# Altium schematic sheet GPIO_M2.SchDoc
size A4
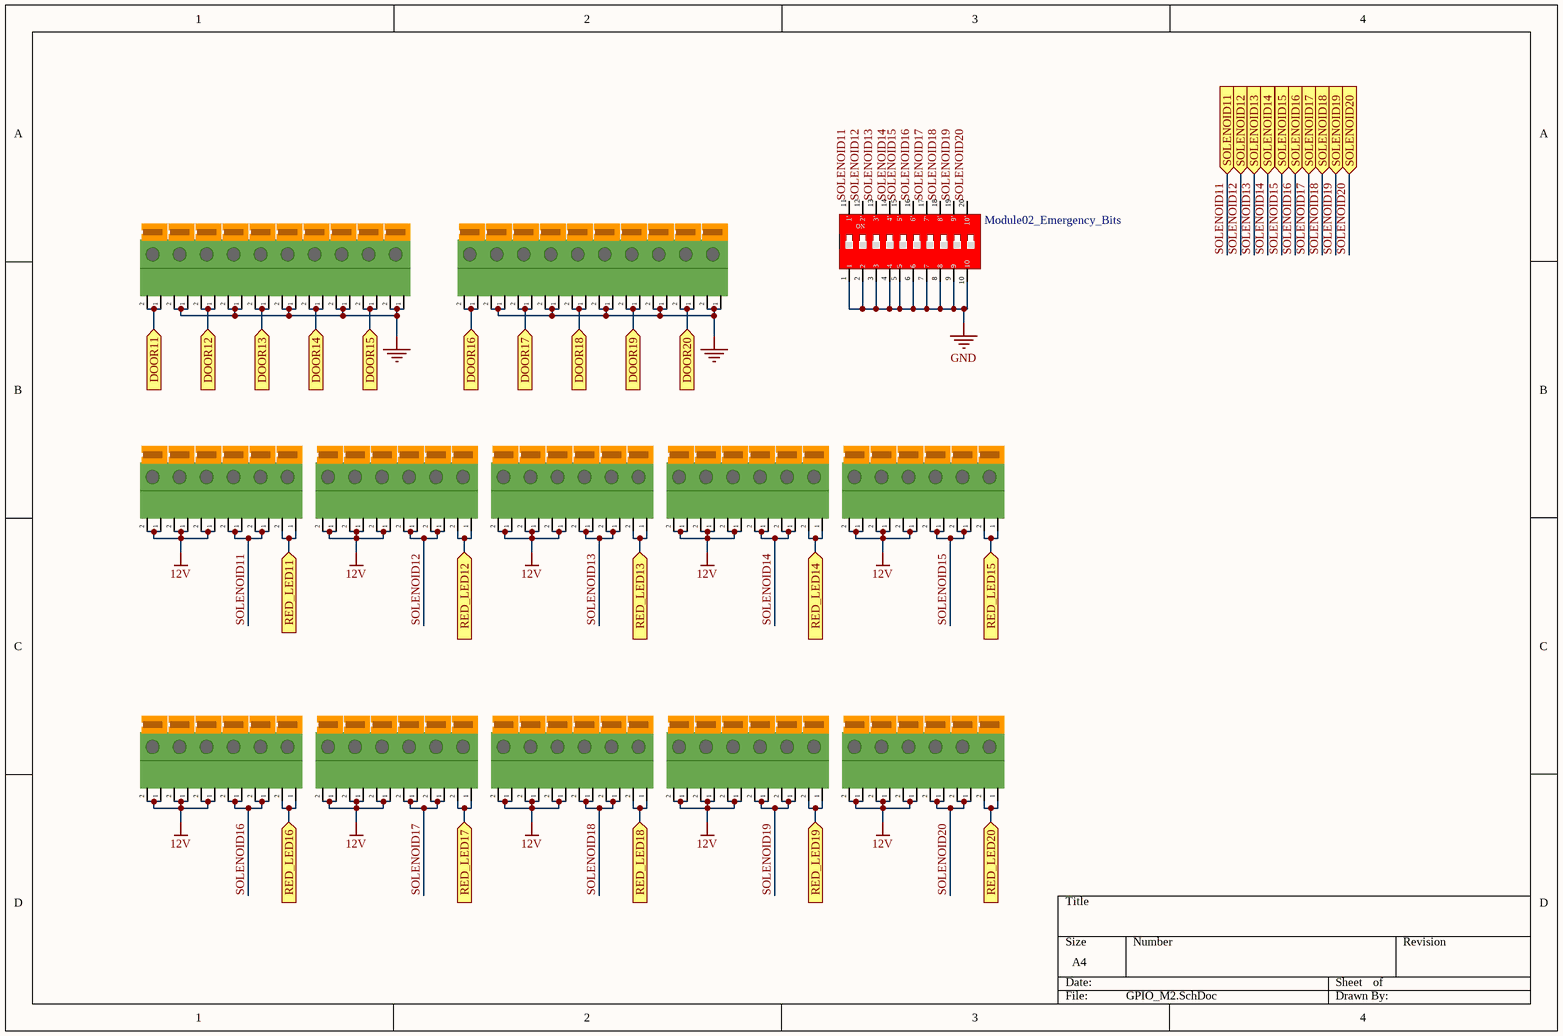
[diagram p0: GPIO_M2.SchDoc]

## Parts
*81  D11  [5#Terminalx1]  (value not drawn)
*82  GND  [5#Terminalx1]  (value not drawn)
*83  D12  [5#Terminalx1]  (value not drawn)
*84  GND  [5#Terminalx1]  (value not drawn)
*85  D13  [5#Terminalx1]  (value not drawn)
*86  GND  [5#Terminalx1]  (value not drawn)
*87  D14  [5#Terminalx1]  (value not drawn)
*88  GND  [5#Terminalx1]  (value not drawn)
*89  D15  [5#Terminalx1]  (value not drawn)
*90  GND  [5#Terminalx1]  (value not drawn)
*91  D16  [5#Terminalx1]  (value not drawn)
*92  GND  [5#Terminalx1]  (value not drawn)
*93  D17  [5#Terminalx1]  (value not drawn)
*94  GND  [5#Terminalx1]  (value not drawn)
*95  D18  [5#Terminalx1]  (value not drawn)
*96  GND  [5#Terminalx1]  (value not drawn)
*97  D19  [5#Terminalx1]  (value not drawn)
*98  GND  [5#Terminalx1]  (value not drawn)
*99  D20  [5#Terminalx1]  (value not drawn)
*100  GND  [5#Terminalx1]  (value not drawn)
*101  12V  [5#Terminalx1]  (value not drawn)
*102  12V  [5#Terminalx1]  (value not drawn)
*103  12V  [5#Terminalx1]  (value not drawn)
*104  S11  [5#Terminalx1]  (value not drawn)
*105  G11  [5#Terminalx1]  (value not drawn)
*106  R11  [5#Terminalx1]  (value not drawn)
*107  12V  [5#Terminalx1]  (value not drawn)
*108  12V  [5#Terminalx1]  (value not drawn)
*109  12V  [5#Terminalx1]  (value not drawn)
*110  S12  [5#Terminalx1]  (value not drawn)
*111  G12  [5#Terminalx1]  (value not drawn)
*112  R12  [5#Terminalx1]  (value not drawn)
*113  12V  [5#Terminalx1]  (value not drawn)
*114  12V  [5#Terminalx1]  (value not drawn)
*115  12V  [5#Terminalx1]  (value not drawn)
*116  S13  [5#Terminalx1]  (value not drawn)
*117  G13  [5#Terminalx1]  (value not drawn)
*118  R13  [5#Terminalx1]  (value not drawn)
*119  12V  [5#Terminalx1]  (value not drawn)
*120  12V  [5#Terminalx1]  (value not drawn)
*121  12V  [5#Terminalx1]  (value not drawn)
*122  S14  [5#Terminalx1]  (value not drawn)
*123  G14  [5#Terminalx1]  (value not drawn)
*124  R14  [5#Terminalx1]  (value not drawn)
*125  12V  [5#Terminalx1]  (value not drawn)
*126  12V  [5#Terminalx1]  (value not drawn)
*127  12V  [5#Terminalx1]  (value not drawn)
*128  S15  [5#Terminalx1]  (value not drawn)
*129  G15  [5#Terminalx1]  (value not drawn)
*130  R15  [5#Terminalx1]  (value not drawn)
*131  12V  [5#Terminalx1]  (value not drawn)
*132  12V  [5#Terminalx1]  (value not drawn)
*133  12V  [5#Terminalx1]  (value not drawn)
*134  S16  [5#Terminalx1]  (value not drawn)
*135  G16  [5#Terminalx1]  (value not drawn)
*136  R16  [5#Terminalx1]  (value not drawn)
*137  12V  [5#Terminalx1]  (value not drawn)
*138  12V  [5#Terminalx1]  (value not drawn)
*139  12V  [5#Terminalx1]  (value not drawn)
*140  S17  [5#Terminalx1]  (value not drawn)
*141  G17  [5#Terminalx1]  (value not drawn)
*142  R17  [5#Terminalx1]  (value not drawn)
*143  12V  [5#Terminalx1]  (value not drawn)
*144  12V  [5#Terminalx1]  (value not drawn)
*145  12V  [5#Terminalx1]  (value not drawn)
*146  S18  [5#Terminalx1]  (value not drawn)
*147  G18  [5#Terminalx1]  (value not drawn)
*148  R18  [5#Terminalx1]  (value not drawn)
*149  12V  [5#Terminalx1]  (value not drawn)
*150  12V  [5#Terminalx1]  (value not drawn)
*151  12V  [5#Terminalx1]  (value not drawn)
*152  S19  [5#Terminalx1]  (value not drawn)
*153  G19  [5#Terminalx1]  (value not drawn)
*154  R19  [5#Terminalx1]  (value not drawn)
*155  12V  [5#Terminalx1]  (value not drawn)
*156  12V  [5#Terminalx1]  (value not drawn)
*157  12V  [5#Terminalx1]  (value not drawn)
*158  S20  [5#Terminalx1]  (value not drawn)
*159  G20  [5#Terminalx1]  (value not drawn)
*160  R20  [5#Terminalx1]  (value not drawn)
Bit2  Module02_Emergency_Bits  [6#Bit_Switch_10]

## Ports
DOOR11 (in), DOOR12 (in), DOOR13 (in), DOOR14 (in), DOOR15 (in), DOOR16 (in), DOOR17 (in), DOOR18 (in), DOOR19 (in), DOOR20 (in), RED_LED11 (in), RED_LED12 (in), RED_LED13 (in), RED_LED14 (in), RED_LED15 (in), RED_LED16 (in), RED_LED17 (in), RED_LED18 (in), RED_LED19 (in), RED_LED20 (in), SOLENOID11 (in), SOLENOID12 (in), SOLENOID13 (in), SOLENOID14 (in), SOLENOID15 (in), SOLENOID16 (in), SOLENOID17 (in), SOLENOID18 (in), SOLENOID19 (in), SOLENOID20 (in)

## Nets
12V: *101.1 *101.2 *102.1 *102.2 *103.1 *103.2 *107.1 *107.2 *108.1 *108.2 *109.1 *109.2 *113.1 *113.2 *114.1 *114.2 *115.1 *115.2 *119.1 *119.2 *120.1 *120.2 *121.1 *121.2 *125.1 *125.2 *126.1 *126.2 *127.1 *127.2 *131.1 *131.2 *132.1 *132.2 *133.1 *133.2 *137.1 *137.2 *138.1 *138.2 *139.1 *139.2 *143.1 *143.2 *144.1 *144.2 *145.1 *145.2 *149.1 *149.2 *150.1 *150.2 *151.1 *151.2 *155.1 *155.2 *156.1 *156.2 *157.1 *157.2
GND: *82.1 *82.2 *84.1 *84.2 *86.1 *86.2 *88.1 *88.2 *90.1 *90.2 *92.1 *92.2 *94.1 *94.2 *96.1 *96.2 *98.1 *98.2 *100.1 *100.2 Bit2.1 Bit2.2 Bit2.3 Bit2.4 Bit2.5 Bit2.6 Bit2.7 Bit2.8 Bit2.9 Bit2.10
DOOR11: *81.1 *81.2 ; port DOOR11
DOOR12: *83.1 *83.2 ; port DOOR12
DOOR13: *85.1 *85.2 ; port DOOR13
DOOR14: *87.1 *87.2 ; port DOOR14
DOOR15: *89.1 *89.2 ; port DOOR15
DOOR16: *91.1 *91.2 ; port DOOR16
DOOR17: *93.1 *93.2 ; port DOOR17
DOOR18: *95.1 *95.2 ; port DOOR18
DOOR19: *97.1 *97.2 ; port DOOR19
DOOR20: *99.1 *99.2 ; port DOOR20
RED_LED11: *106.1 *106.2 ; port RED_LED11
RED_LED12: *112.1 *112.2 ; port RED_LED12
RED_LED13: *118.1 *118.2 ; port RED_LED13
RED_LED14: *124.1 *124.2 ; port RED_LED14
RED_LED15: *130.1 *130.2 ; port RED_LED15
RED_LED16: *136.1 *136.2 ; port RED_LED16
RED_LED17: *142.1 *142.2 ; port RED_LED17
RED_LED18: *148.1 *148.2 ; port RED_LED18
RED_LED19: *154.1 *154.2 ; port RED_LED19
RED_LED20: *160.1 *160.2 ; port RED_LED20
SOLENOID11: *104.1 *104.2 *105.1 *105.2 Bit2.11(1') ; port SOLENOID11
SOLENOID12: *110.1 *110.2 *111.1 *111.2 Bit2.12(2') ; port SOLENOID12
SOLENOID13: *116.1 *116.2 *117.1 *117.2 Bit2.13(3') ; port SOLENOID13
SOLENOID14: *122.1 *122.2 *123.1 *123.2 Bit2.14(4') ; port SOLENOID14
SOLENOID15: *128.1 *128.2 *129.1 *129.2 Bit2.15(5') ; port SOLENOID15
SOLENOID16: *134.1 *134.2 *135.1 *135.2 Bit2.16(6') ; port SOLENOID16
SOLENOID17: *140.1 *140.2 *141.1 *141.2 Bit2.17(7') ; port SOLENOID17
SOLENOID18: *146.1 *146.2 *147.1 *147.2 Bit2.18(8') ; port SOLENOID18
SOLENOID19: *152.1 *152.2 *153.1 *153.2 Bit2.19(9') ; port SOLENOID19
SOLENOID20: *158.1 *158.2 *159.1 *159.2 Bit2.20(10') ; port SOLENOID20

## Notes on the sheet
- (in symbol 6#Bit_Switch_10) ON

## Library data of the parts
*81-*160 = 5#Terminalx1
Bit2 = 6#Bit_Switch_10